# Altium project PCB_Project1.PrjPcb
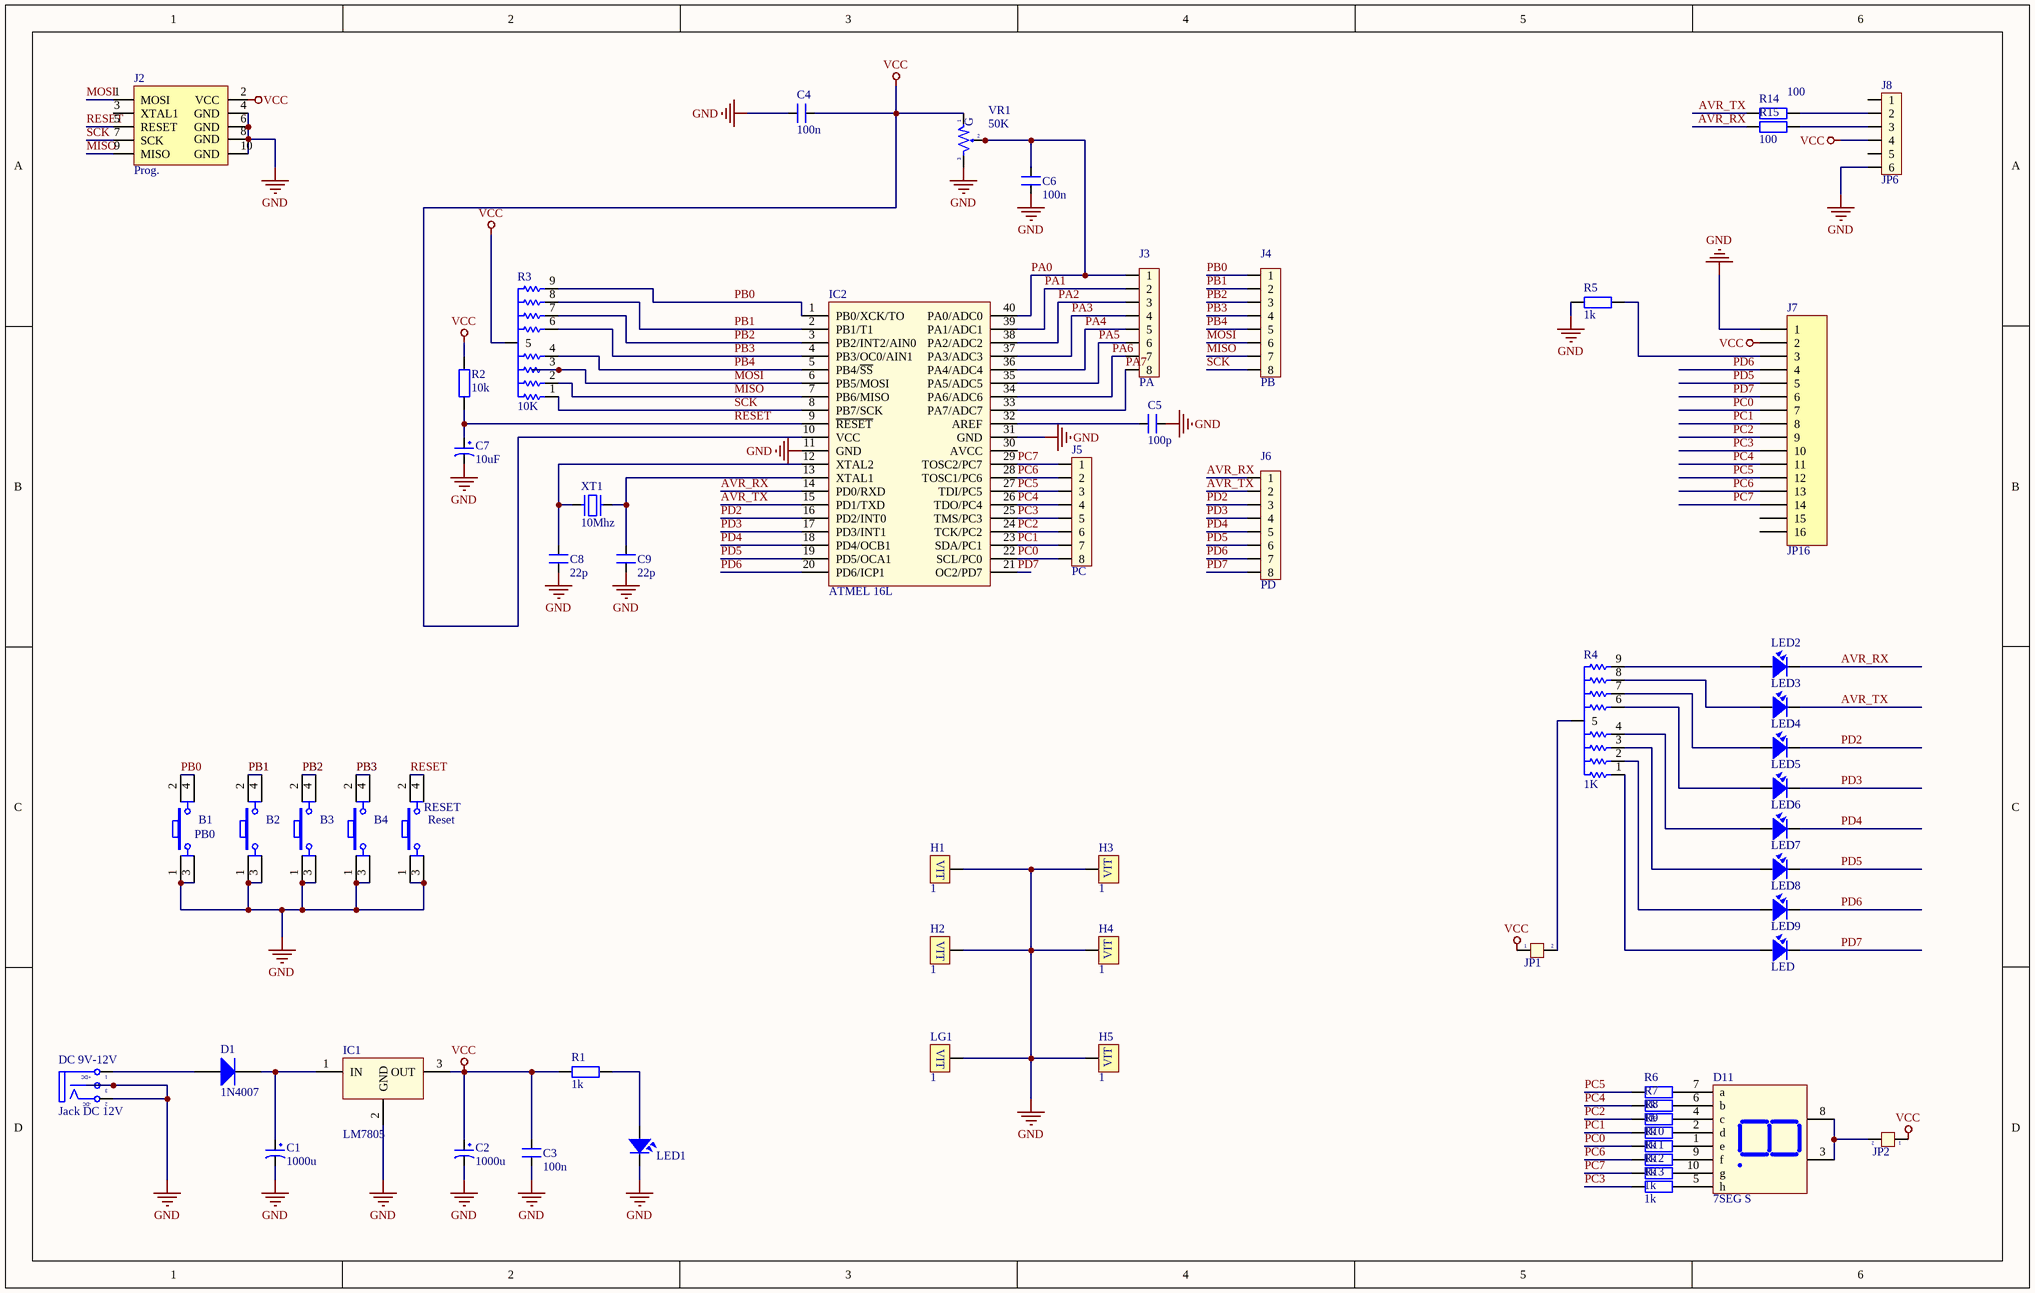
[diagram p0: Sheet1.SchDoc]
1 sheet, 60 parts. Net scope: global (net labels, ports and power ports of the same name join across sheets).
Board file: PCB1.PcbDoc

## Sheet Sheet1.SchDoc
size 381 x 241 mm

### Parts
C1  1000u  [CP1/2]
C2  1000u  [CP1/2]
C3  100n  [CN1]
C4  100n  [CN1]
C5  100p  [CN1]
C6  100n  [CN1]
C7  10uF  [CP1/2]
C8  22p  [CN1]
C9  22p  [CN1]
D1  1N4007  [DO-41]
D11  7SEG S  [7SEGS]
DC_9V-12V  Jack DC 12V  [DC-IN]
H1  1  [VIT]
H2  1  [VIT]
H3  1  [VIT]
H4  1  [VIT]
H5  1  [VIT]
IC1  LM7805  [78l05]
IC2  ATMEL 16L  [DIP40/W0.6]
J2  Prog.  [ISP]
J3  PA  [JP8]
J4  PB  [JP8]
J5  PC  [JP8]
J6  PD  [JP8]
J7  JP16  [JP16-D1C]
J8  JP6  [JP6]
JP1  Jumper 2  [JP2]  (value not drawn)
JP2  Jumper 2  [JP2]  (value not drawn)
LED1  LED  [LED-3MM-YELLOW]  (value not drawn)
LED2  LED  [LED-3]
LED3  LED  [LED-3]
LED4  LED  [LED-3]
LED5  LED  [LED-3]
LED6  LED  [LED-3]
LED7  LED  [LED-3]
LED8  LED  [LED-3]
LED9  LED  [LED-3]
LG1  1  [VIT]
PB0  B1  [SW4]
PB1  B2  [SW4]
PB2  B3  [SW4]
PB3  B4  [SW4]
R1  1k  [R1/4W]
R2  10k  [R1/4W]
R3  10K  [RN8]
R4  1K  [RN8]
R5  1k  [R1/4W]
R6  1k  [R1/4W]
R7  1k  [R1/4W]
R8  1k  [R1/4W]
R9  1k  [R1/4W]
R10  1k  [R1/4W]
R11  1k  [R1/4W]
R12  1k  [R1/4W]
R13  1k  [R1/4W]
R14  100  [R1/4W]
R15  100  [R1/4W]
RESET  Reset  [SW4]
VR1  50K  [VR-S3]
XT1  10Mhz  [XT2]

### Nets
GND: C1.2 C2.2 C3.2 C4.2 C5.1 C6.2 C7.2 C8.1 C9.1 DC_9V-12V.2(TN) DC_9V-12V.3(S) H1.VIT1 H2.VIT1 H3.VIT1 H4.VIT1 H5.VIT1 IC1.2(GND) IC2.11(GND) IC2.31(GND) J2.4(GND) J2.6(GND) J2.8(GND) J2.10(GND) J7.1 J8.6 LED1.2 LG1.VIT1 PB0.1 PB0.3 PB1.1 PB1.3 PB2.1 PB2.3 PB3.1 PB3.3 R5.1 RESET.1 RESET.3 VR1.3
VCC: C2.1 C3.1 C4.1 IC1.3(OUT) IC2.10(VCC) J2.2(VCC) J7.2 J8.4 JP1.1 JP2.1 R1.1 R2.2 R3.5 VR1.1
AVR_RX: IC2.14(PD0/RXD) J6.1 LED2.2 R15.1
AVR_TX: IC2.15(PD1/TXD) J6.2 LED3.2 R14.1
MISO: IC2.7(PB6/MISO) J2.9(MISO) J4.7 R3.2
MOSI: IC2.6(PB5/MOSI) J2.1(MOSI) J4.6 R3.3
PA0: C6.1 IC2.40(PA0/ADC0) J3.1 VR1.2
PA1: IC2.39(PA1/ADC1) J3.2
PA2: IC2.38(PA2/ADC2) J3.3
PA3: IC2.37(PA3/ADC3) J3.4
PA4: IC2.36(PA4/ADC4) J3.5
PA5: IC2.35(PA5/ADC5) J3.6
PA6: IC2.34(PA6/ADC6) J3.7
PA7: IC2.33(PA7/ADC7) J3.8
PB0: IC2.1(PB0/XCK/TO) J4.1 PB0.2 PB0.4 R3.9
PB1: IC2.2(PB1/T1) J4.2 PB1.2 PB1.4 R3.8
PB2: IC2.3(PB2/INT2/AIN0) J4.3 PB2.2 PB2.4 R3.7
PB3: IC2.4(PB3/OC0/AIN1) J4.4 PB3.2 PB3.4 R3.6
PB4: IC2.5(PB4/~{SS}) J4.5 R3.4
PC0: IC2.22(SCL/PC0) J5.8 J7.7 R10.1
PC1: IC2.23(SDA/PC1) J5.7 J7.8 R9.1
PC2: IC2.24(TCK/PC2) J5.6 J7.9 R8.1
PC3: IC2.25(TMS/PC3) J5.5 J7.10 R13.1
PC4: IC2.26(TDO/PC4) J5.4 J7.11 R7.1
PC5: IC2.27(TDI/PC5) J5.3 J7.12 R6.1
PC6: IC2.28(TOSC1/PC6) J5.2 J7.13 R11.1
PC7: IC2.29(TOSC2/PC7) J5.1 J7.14 R12.1
PD2: IC2.16(PD2/INT0) J6.3 LED4.2
PD3: IC2.17(PD3/INT1) J6.4 LED5.2
PD4: IC2.18(PD4/OCB1) J6.5 LED6.2
PD5: IC2.19(PD5/OCA1) J6.6 J7.5 LED7.2
PD6: IC2.20(PD6/ICP1) J6.7 J7.4 LED8.2
PD7: IC2.21(OC2/PD7) J6.8 J7.6 LED9.2
RESET: C7.1 IC2.9(~{RESET}) J2.5(RESET) R2.1 RESET.2 RESET.4
SCK: IC2.8(PB7/SCK) J2.7(SCK) J4.8 R3.1
NetC1_1: C1.1 D1.2(K) IC1.1(IN)
NetC5_2: C5.2 IC2.32(AREF)
NetC8_2: C8.2 IC2.12(XTAL2) XT1.1
NetC9_2: C9.2 IC2.13(XTAL1) XT1.2
NetD1_1: D1.1(A) DC_9V-12V.1(T)
NetD11_1: D11.1(e) R10.2
NetD11_2: D11.2(d) R9.2
NetD11_3: D11.3(Vcc) D11.8(Vcc) JP2.2
NetD11_4: D11.4(c) R8.2
NetD11_5: D11.5(h) R13.2
NetD11_6: D11.6(b) R7.2
NetD11_7: D11.7(a) R6.2
NetD11_9: D11.9(f) R11.2
NetD11_10: D11.10(g) R12.2
NetJ7_3: J7.3 R5.2
NetJ8_2: J8.2 R14.2
NetJ8_3: J8.3 R15.2
NetJP1_2: JP1.2 R4.5
NetLED1_1: LED1.1 R1.2
NetLED2_1: LED2.1 R4.9
NetLED3_1: LED3.1 R4.8
NetLED4_1: LED4.1 R4.7
NetLED5_1: LED5.1 R4.6
NetLED6_1: LED6.1 R4.4
NetLED7_1: LED7.1 R4.3
NetLED8_1: LED8.1 R4.2
NetLED9_1: LED9.1 R4.1

Not connected (* = marked no-connect by the designer): IC2 30(AVCC); J2 3(XTAL1); J7 15 16; J8 1 5

### Notes on the sheet
- (in symbol Jac_DC) +DC; -DC
- (in symbol VR-S) G

### Library data of the parts
C1 C2 C7 = CP1: Cap P  0,1uF < 22uF , 16 - 50V; Value: 10uF/50V; Description 1: 10 => 220uF/6,3V/10V - 10uF => 100uF/16V; Description 2: 0,1uF => 33uF/50V - 10uF => 22uF/63V; Description 3: 0,47uF => 10uF/100V
C3-C6 C8 C9 = CN1: Cap np  1pF - 472pF; Value: 100pF
D1 = Diode 1N4007: 1 Amp General Purpose Rectifier; Published: 8-Jun-2000; LatestRevisionDate: 17-Jul-2002; LatestRevisionNote: Re-released for DXP Platform.; DatasheetVersion: 1998; PackageVersion: Aug-1999; PackageReference: DO-41; Publisher: Altium Limited; PackageDescription: Diode, Axial; Body 5.2 x 2.7 mm (LxDia. max), Lead Dia. 0.86 mm (max); Code_JEDEC: DO-204-AL; ComponentLink1Description: Manufacturer Link; ComponentLink1URL: http://www.fairchildsemi.com/; ComponentLink2Description: Datasheet; ComponentLink2URL: http://www.fairchildsemi.com/ds/1N%2F1N4001.pdf
D11 = LED7S: Single 7 Seg Dipslay; Value: LED 7S SEG
DC_9V-12V = Jac_DC: Cắm; Ten_Linh_Kien: Jack DC5.5x2.1MM DC5501; Ma_Hang: MH000923; Don_Vi: Con; Kieu_Chan: *; Ghi_Chu: *; Chung_Loai: Cắm
H1-H5 LG1 = VIT: Oc Vit
IC1 = LM78xx: On ap +, from + 5 to + 24VDC; Value: LM7805
IC2 = Atmega16L: 8-Bit AVR Microcontroller with 16K Bytes of In-System Programmable Flash Memory; Value: Atmega 16L
J2 = ISP
J3-J6 = JP8: JP8 PIN; Value: JP7
J7 = JP16: WR-PHD 2.54 mm Angled Socket Header; Manufacturer: W¨¹rth Elektronik eiSos GmbH; partNo: 613016143121; ComponentLink1 Description: Manufacturer; ComponentLink2 Description: Datasheet; NoPins: 16; Created Date: 29 March 2013; ComponentLink1URL: http://www.we-online.com; ComponentLink2URL: http://katalog.we-online.de/em/datasheet/6130xx143121.pdf; Created by: Karrer Zheng
J8 = JP6: JP6 PIN; Value: JP7
JP1 JP2 = JP 2: Value: JP 2
LED1-LED9 = LED: LED Single colour Green and Red; Value: LED 3 ly Single Colour
PB0-PB3 RESET = SW4: Switch button 4 pin; Value: Button chip 4 pin
R1 R2 R5-R15 = R1/4W: Resistor 1/4W; Value: R1/4W - 1K
R3 = RKC8LD: Resistor Pack 4x2; Value: 10K
R4 = RKC8LD: Resistor Pack 4x2; Value: 10K
VR1 = VR-S: Var Resistor; Value: Volume 50k
XT1 = XT2: Crystal For all Crystal 2pin.; Value: 4Mhz